# Altium project PCB3.PrjPcb
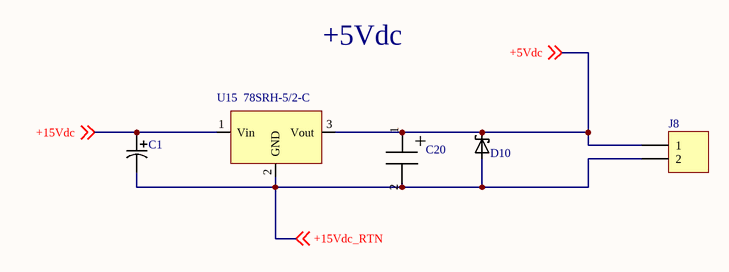
[diagram p0: +5Vdc.SchDoc]
4 sheets, 68 parts. Net scope: flat (ports and power ports of the same name join across sheets).
Board file: Hoja6_8.PcbDoc
Sheets:
  +5Vdc.SchDoc
  +15V_fire.SchDoc
  Control_tensiones.SchDoc
  Enable_Pulse_fire.SchDoc

## Sheet +5Vdc.SchDoc
size A3

### Parts
C1  UBC1H470MNS1GS  [UBC1H470MNS1GS]  (value not drawn)
C20  10SVPC120M  [PANASONIC SVPC SERIES]  (value not drawn)
D10  SMCJ5.0A  [TVS Diode DO-214AB-2 (SMC)]  (value not drawn)
J8  Header 2  [HDR1X2]  (value not drawn)
U15  78SRH-5/2-C  [78SR-5/2-C]

### Nets
+5Vdc: C20.1 D10.C J8.1 U15.3(Vout) ; off-sheet +5Vdc
+15Vdc: C1.1 U15.1(Vin) ; off-sheet +15Vdc
+15Vdc_RTN: C1.2 C20.2 D10.A J8.2 U15.2(GND) ; off-sheet +15Vdc_RTN

### Notes on the sheet
- +5Vdc
- (in symbol Panasonic electrolitic cap SVPC) +

### Library data of the parts
C1 = Nichicon electrolitic capacitor: MD 50volts 47uF; ComponentLink1Description: UBC1H470MNS1GS; ComponentLink1URL: https://www.mouser.es/ProductDetail/Nichicon/UBC1H470MNS1GS?qs=U1PqRs5SEBtOy06pTkWJCw%3D%3D&vip=1&gclid=CjwKCAjwqpP2BRBTEiwAfpiD-zT2IHj2dmGJDoxoCUlwFGgo7ytp52iPk_zVmh_n4eTfZDHl6q4jrxoCD5AQAvD_BwE
C20 = Panasonic electrolitic cap SVPC: 10volts 120uF ESR 27mohm; ComponentLink1Description: 10SVPC120M; ComponentLink1URL: https://www.mouser.es/ProductDetail/Panasonic/10SVPC120M?qs=sGAEpiMZZMsIwzbKW1rlgZRRlI97jKasVTg%2Fx1x3B4w%3D
D10 = TVS SMCJxxA: SMC do-214AB-2; ComponentLink1Description: SMCJ5.0A; ComponentLink1URL: https://www.mouser.es/ProductDetail/Bourns/SMCJ50A?qs=%252Bf8Cd6aE5bxP5YHLnOwndA%3D%3D
J8 = Header 2: Header, 2-Pin; LatestRevisionDate: 17-Jul-2002; LatestRevisionNote: Re-released for DXP Platform.; Publisher: Altium Limited
U15 = 78SR-5/2-C: Convertidores CC/CC no aislados 8-32Vin 5Vout 2A SIP Switching Reg.; ComponentLink1Description: 78SRH-5/2-C; ComponentLink1URL: https://www.mouser.es/ProductDetail/Murata-Power-Solutions/78SRH-5-2-C?qs=%2Fha2pyFaduhqPOpHwIdzX%252BmJBXU5MwVRtt0xC2MUQi8aOSO3n%252BGaGw%3D%3D; ComponentLink2Description: Datasheet; ComponentLink2URL: https://www.mouser.es/datasheet/2/281/mpm_78sr-2a_a00-42390.pdf

## Sheet +15V_fire.SchDoc
size A3
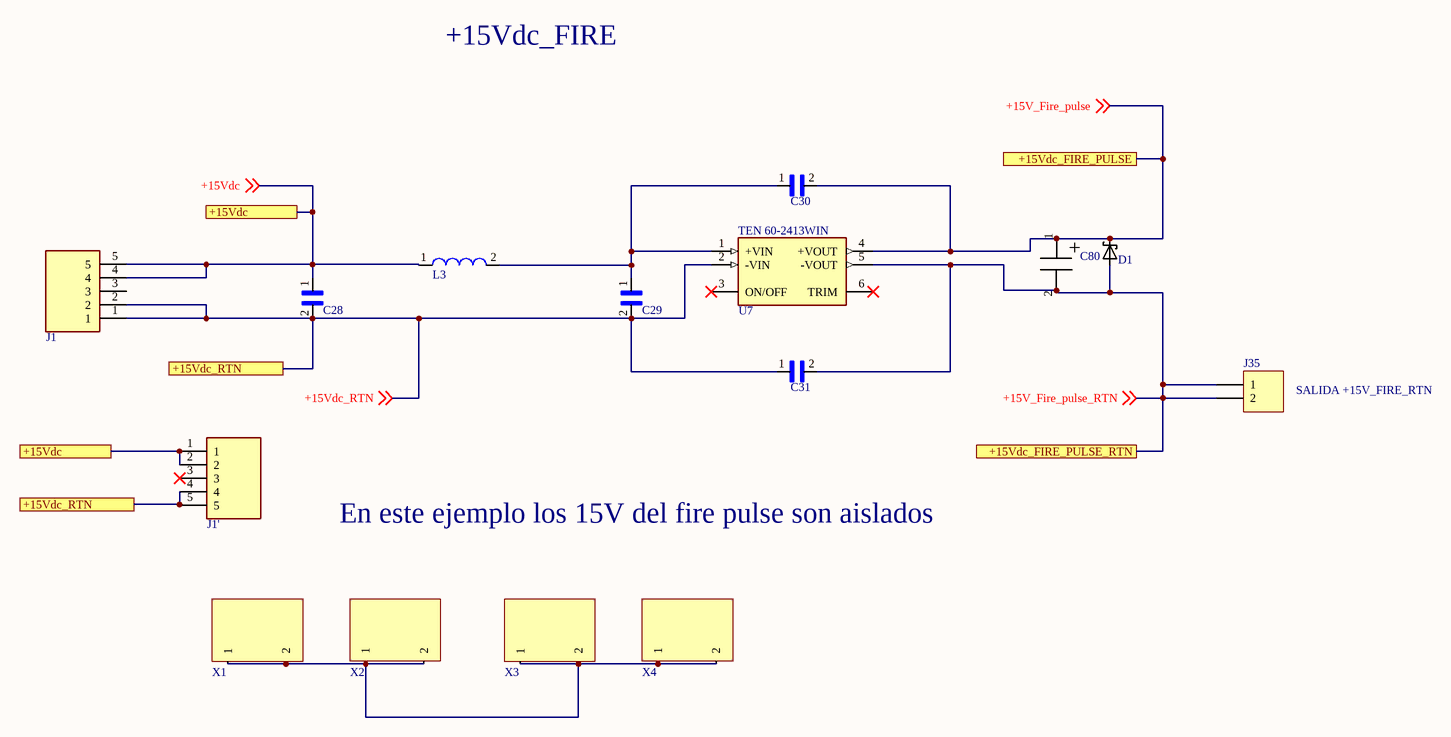
[diagram p1: +15V_fire.SchDoc]

### Parts
C28  KTF500B685M43NHT00  [MLCC SMD 1812 50V]  (value not drawn)
C29  KTF500B685M43NHT00  [MLCC SMD 1812 50V]  (value not drawn)
C30  C1206X102KGRACAUTO  [MLCC SMD 1206]  (value not drawn)
C31  C1206X102KGRACAUTO  [MLCC SMD 1206]  (value not drawn)
C80  EEE-FK1V100R  [PANASONIC FK SERIES]  (value not drawn)
D1  SMCJ15A  [TVS Diode DO-214AB-2 (SMC)]  (value not drawn)
J1  Pin Header 5x1 MASC  [PIN HEADER 5X1 MASC]  (value not drawn)
J1'  Pin Header 5x1 MASC  [PIN HEADER 5X1 MASC]  (value not drawn)
J35  Header 2  [HDR1X2]  (value not drawn)
L3  TCK-102  [TCK-102]  (value not drawn)
U7  TEN 60-2413WIN  [TEN 60WIN Series]
X1  7466310R  [7466310R]  (value not drawn)
X2  7466310R  [7466310R]  (value not drawn)
X3  7466310R  [7466310R]  (value not drawn)
X4  7466310R  [7466310R]  (value not drawn)

### Ports
+15Vdc, +15Vdc_FIRE_PULSE, +15Vdc_FIRE_PULSE_RTN, +15Vdc_RTN

### Nets
+15V_Fire_pulse: C30.2 C80.1 D1.C U7.4(+VOUT) ; off-sheet +15V_Fire_pulse, port +15Vdc_FIRE_PULSE
+15V_Fire_pulse_RTN: C31.2 C80.2 D1.A J35.1 J35.2 U7.5(-VOUT) ; off-sheet +15V_Fire_pulse_RTN, port +15Vdc_FIRE_PULSE_RTN
+15Vdc: C28.1 J1.4 J1.5 J1'.1 J1'.2 L3.1 ; off-sheet +15Vdc, port +15Vdc
+15Vdc_RTN: C28.2 C29.2 C31.1 J1.1 J1.2 J1'.4 J1'.5 U7.2(-VIN) ; off-sheet +15Vdc_RTN, port +15Vdc_RTN
NetC29_1: C29.1 C30.1 L3.2 U7.1(+VIN)
NetX1_1: X1.1 X1.2 X2.1 X2.2 X3.1 X3.2 X4.1 X4.2

Not connected (* = marked no-connect by the designer): J1 3; J1' 3*; U7 3(ON/OFF)* 6(TRIM)*

### Notes on the sheet
- +15Vdc_FIRE
- (near J35) SALIDA +15V_FIRE_RTN
- En este ejemplo los 15V del fire pulse son aislados
- (in symbol Panasonic electrolitic cap FK) +

### Library data of the parts
C28 C29 = MLCC - SMD 1812: 6.8uF, 50V; ComponentLink1Description: KTF500B685M43NHT00; ComponentLink1URL: https://www.mouser.es/ProductDetail/United-Chemi-Con/KTF500B685M43NHT00?qs=sGAEpiMZZMs0AnBnWHyRQGxBDRtFRp5z4bchVqSxespDGMPT39T5iA%3D%3D
C30 C31 = MLCC - SMD 1206: 1000Pf, 2KV; ComponentLink1Description: C1206X102KGRACAUTO; ComponentLink1URL: https://www.mouser.es/ProductDetail/KEMET/C1206X102KGRACAUTO?qs=sGAEpiMZZMs0AnBnWHyRQN7%2FAA2D2lPPgicmiaZAeQEuINLX1UMksw%3D%3D
C80 = Panasonic electrolitic cap FK: 10uF, 35V; ComponentLink1Description: EEE-FK1V100R; ComponentLink1URL: https://www.mouser.es/ProductDetail/Panasonic/EEE-FK1V100R?qs=%2Fha2pyFaduj%2FIt2M0EHCFH6KCxiBIGyUhvn03lKjROYI3CJTVtBsWg%3D%3D
D1 = TVS SMCJxxA: SMC do-214AB-2; ComponentLink1Description: SMCJ15A; ComponentLink1URL: https://www.mouser.es/ProductDetail/Taiwan-Semiconductor/SMCJ15A?qs=sGAEpiMZZMvxHShE6Whpu8fatLI1nnJdRhHnBKQQd%2F4%3D
J1 J1' = Pin Header 5x1 MASC: 5x1 Straight MASC
J35 = Header 2: Header, 2-Pin; LatestRevisionDate: 17-Jul-2002; LatestRevisionNote: Re-released for DXP Platform.; Publisher: Altium Limited
L3 = TCK-102: Inductores fijos EMC Chokes for DC/DC Converters 3.3 µH ±20% 18 mOhm max. 10Amax; ComponentLink1Description: TCK-102; ComponentLink1URL: https://www.mouser.es/datasheet/2/687/tck102-1530275.pdf; ComponentLink2Description: TCK-102; ComponentLink2URL: https://www.mouser.es/ProductDetail/TRACO-Power/TCK-102?qs=sGAEpiMZZMvzWM6X48YRJGsDNyjYsBLz4RP5FeQoV5Q%3D
U7 = TEN 60-2413WIN: Convertidores CC/CC aislados  Output Power (W): 60; Input Voltage: 9-36 VDC; Output 1 (Vdc): 15;; ComponentLink1Description: Datasheet; ComponentLink1URL: https://www.tracopower.com/sites/default/files/products/datasheets/ten60win_datasheet.pdf; ComponentLink2Description: TEN 60-2413WIN; ComponentLink2URL: https://www.mouser.es/ProductDetail/TRACO-Power/TEN-60-2413WIN?qs=sGAEpiMZZMvGsmoEFRKS8GuhBnqedIdiF3IPykuOfGu%2FdWm0yPRwSg%3D%3D
X1-X4 = 7466310R Conector: ComponentLink1Description: 7466310R; ComponentLink1URL: https://es.rs-online.com/web/p/terminales-roscados/1424083/

## Sheet Control_tensiones.SchDoc
size A3
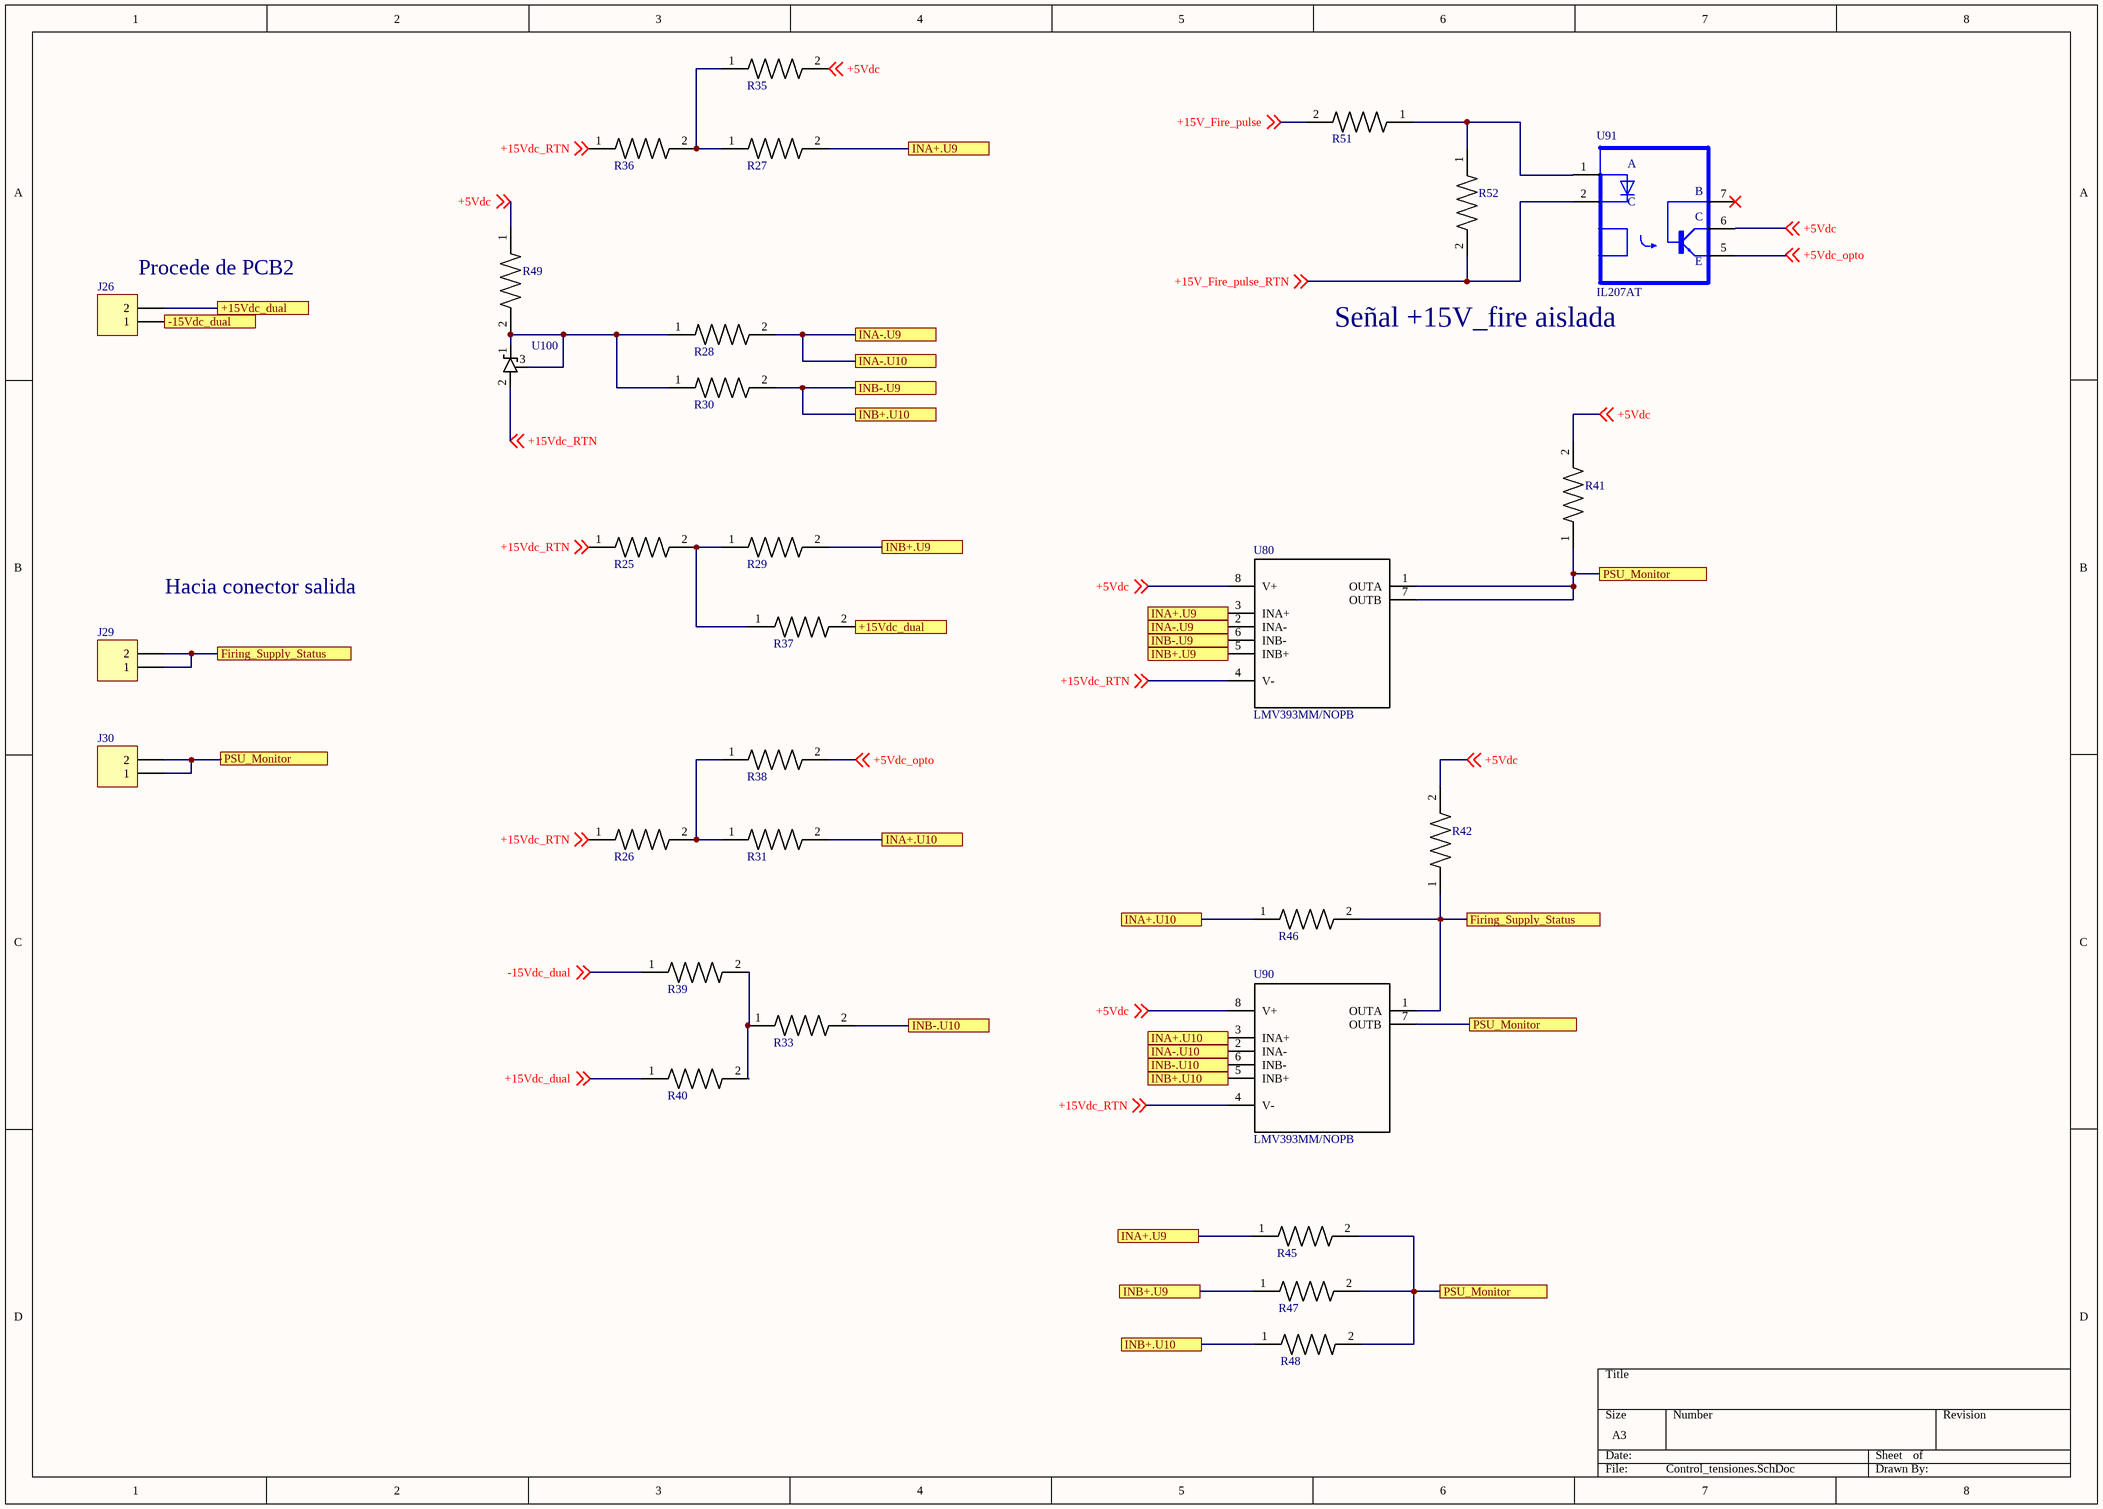
[diagram p2: Control_tensiones.SchDoc]

### Parts
J26  Header 2  [HDR1X2]  (value not drawn)
J29  Header 2  [HDR1X2]  (value not drawn)
J30  Header 2  [HDR1X2]  (value not drawn)
R25  MCT06030C2261FP500  [VISHAY RESISTOR 0603]  (value not drawn)
R26  MCT06030C2261FP500  [VISHAY RESISTOR 0603]  (value not drawn)
R27  MCT06030C4751FP500  [VISHAY RESISTOR 0603]  (value not drawn)
R28  MCT06030C4751FP500  [VISHAY RESISTOR 0603]  (value not drawn)
R29  MCT06030C4751FP500  [VISHAY RESISTOR 0603]  (value not drawn)
R30  MCT06030C4751FP500  [VISHAY RESISTOR 0603]  (value not drawn)
R31  MCT06030C4751FP500  [VISHAY RESISTOR 0603]  (value not drawn)
R33  MCT06030C4751FP500  [VISHAY RESISTOR 0603]  (value not drawn)
R35  MCT06030C8251FP500  [VISHAY RESISTOR 0603]  (value not drawn)
R36  MCT06030E1002BP500  [VISHAY RESISTOR 0603]  (value not drawn)
R37  MCT06030E1002BP500  [VISHAY RESISTOR 0603]  (value not drawn)
R38  MCT06030C8251FP500  [VISHAY RESISTOR 0603]  (value not drawn)
R39  MCT06030E1002BP500  [VISHAY RESISTOR 0603]  (value not drawn)
R40  MCT06030E1002BP500  [VISHAY RESISTOR 0603]  (value not drawn)
R41  MCT06030E1002BP500  [VISHAY RESISTOR 0603]  (value not drawn)
R42  MCT06030E1002BP500  [VISHAY RESISTOR 0603]  (value not drawn)
R45  MCT06030C2213FP500  [VISHAY RESISTOR 0603]  (value not drawn)
R46  MCT06030C2213FP500  [VISHAY RESISTOR 0603]  (value not drawn)
R47  MCT06030C2213FP500  [VISHAY RESISTOR 0603]  (value not drawn)
R48  MCT06030C2213FP500  [VISHAY RESISTOR 0603]  (value not drawn)
R49  MCT06030C1001FP500  [VISHAY RESISTOR 0603]  (value not drawn)
R51  CR1206-FX-3921ELF  [Vishay Resistor 1206]  (value not drawn)
R52  CR1206-FX-2211ELF  [Vishay Resistor 1206]  (value not drawn)
U80  LMV393MM/NOPB  [VSSOP-8]
U90  LMV393MM/NOPB  [VSSOP-8]
U91  IL207AT  [IL207AT]
U100  LM431BIM3/NOPB  [LM431BIM3/NOPB]  (value not drawn)

### Ports
+15Vdc_dual, -15Vdc_dual, Firing_Supply_Status, INA+.U9, INA+.U10, INA-.U9, INA-.U10, INB+.U9, INB+.U10, INB-.U9, INB-.U10, PSU_Monitor

### Nets
+5Vdc: R35.2 R41.2 R42.2 R49.1 U80.8(V+) U90.8(V+) U91.6(C) ; off-sheet +5Vdc
+5Vdc_opto: R38.2 U91.5(E) ; off-sheet +5Vdc_opto
+15V_Fire_pulse: R51.2 ; off-sheet +15V_Fire_pulse
+15V_Fire_pulse_RTN: R52.2 U91.2(K) ; off-sheet +15V_Fire_pulse_RTN
+15Vdc_dual: R40.1 ; off-sheet +15Vdc_dual
+15Vdc_RTN: R25.1 R26.1 R36.1 U80.4(V-) U90.4(V-) U100.2 ; off-sheet +15Vdc_RTN
-15Vdc_dual: R39.1 ; off-sheet -15Vdc_dual
NetJ26_1: J26.1 ; port -15Vdc_dual
NetJ26_2: J26.2 R37.2 ; port +15Vdc_dual
NetJ29_1: J29.1 J29.2 R42.1 R46.2 U90.1(OUTA) ; port Firing_Supply_Status
NetJ30_1: J30.1 J30.2 R41.1 R45.2 R47.2 R48.2 U80.1(OUTA) U80.7(OUTB) U90.7(OUTB) ; port PSU_Monitor
NetR25_2: R25.2 R29.1 R37.1
NetR26_2: R26.2 R31.1 R38.1
NetR27_1: R27.1 R35.1 R36.2
NetR27_2: R27.2 R45.1 U80.3(INA+) ; port INA+.U9
NetR28_1: R28.1 R30.1 R49.2 U100.1 U100.3
NetR28_2: R28.2 U80.2(INA-) U90.2(INA-) ; port INA-.U9, port INA-.U10
NetR29_2: R29.2 R47.1 U80.5(INB+) ; port INB+.U9
NetR30_2: R30.2 R48.1 U80.6(INB-) U90.5(INB+) ; port INB-.U9, port INB+.U10
NetR31_2: R31.2 R46.1 U90.3(INA+) ; port INA+.U10
NetR33_1: R33.1 R39.2 R40.2
NetR33_2: R33.2 U90.6(INB-) ; port INB-.U10
NetR51_1: R51.1 R52.1 U91.1(A)

Not connected (* = marked no-connect by the designer): U91 7(B)*

### Notes on the sheet
- (near J26) Procede de PCB2
- Señal +15V_fire aislada
- Hacia conector salida

### Library data of the parts
J26 J29 J30 = Header 2: Header, 2-Pin; LatestRevisionDate: 17-Jul-2002; LatestRevisionNote: Re-released for DXP Platform.; Publisher: Altium Limited
R25 R26 = Vishay: SMD .1W 2.26Kohms 1% 0603 50ppm; ComponentLink1Description: MCT06030C2261FP500; ComponentLink1URL: https://www.mouser.es/ProductDetail/Vishay-Beyschlag/MCT06030C2261FP500?qs=%2Fha2pyFadughkIXC22QiYpvHZcDRlhgpmBDp13US%252BZ0hODV2hOC%2FTUaEC1yDML2l
R27-R31 R33 = Vishay: SMD .1W 4.75Kohm 1% 0603; ComponentLink1Description: MCT06030C4751FP500; ComponentLink1URL: https://www.mouser.es/ProductDetail/Vishay-Beyschlag/MCT06030C4751FP500?qs=%2Fha2pyFadughkIXC22QiYi0CgI7B%2FEwZF1Ozbr1oOh0X%252BJ1hWtmp5jEjAUZkpAxV
R35 R38 = Vishay: 8.25K; ComponentLink1Description: MCT06030C8251FP500; ComponentLink1URL: https://www.mouser.es/ProductDetail/Vishay-Beyschlag/MCT06030C8251FP500?qs=sGAEpiMZZMukHu%252BjC5l7YZ4AW6xLIgwogvAy%252BPWxcIo%3D
R36 R37 R39-R42 = Vishay: 10K; ComponentLink1Description: MCT06030E1002BP500; ComponentLink1URL: https://www.mouser.es/ProductDetail/Vishay-Beyschlag/MCT06030E1002BP500?qs=%2Fha2pyFadughkIXC22QiYn1joc4AhucvlApKkzkxat0vQHQ4MiMQdVZR1CdxMQHv
R45-R48 = Vishay: 221K; ComponentLink1Description: MCT06030C2213FP500; ComponentLink1URL: https://www.mouser.es/ProductDetail/Vishay-Beyschlag/MCT06030C2213FP500?qs=%2Fha2pyFadughkIXC22QiYqLjBpdqF1aqE52QKndS2LMwEPewZL3fBw%3D%3D
R49 = Vishay: 1K; ComponentLink1Description: MCT06030C1001FP500; ComponentLink1URL: https://www.mouser.es/ProductDetail/Vishay-Beyschlag/MCT06030C1001FP500?qs=%2Fha2pyFadughkIXC22QiYtrFzwOcctIEKEUg7pOtZAzbqCmtrkpt9w%3D%3D
R51 = Vishay: SMD 3.92K 1%; ComponentLink1Description: CR1206-FX-3921ELF; ComponentLink1URL: https://www.mouser.es/ProductDetail/Bourns/CR1206-FX-3921ELF?qs=raSpJxvwqHE9GBxJCDuxsA%3D%3D
R52 = Vishay: SMD 2.21K 1%; ComponentLink1Description: CR1206-FX-2211ELF; ComponentLink1URL: https://www.mouser.es/ProductDetail/Bourns/CR1206-FX-2211ELF?qs=%2Fha2pyFaduj9c30axezgKfVr70F7xSB9ko%2Fa2tHaHRQ2Kj0njWzInQ%3D%3D
U80 U90 = LMV393MM/NOPB: Low Volt Dual Comp; ComponentLink1Description: Datasheets; ComponentLink1URL: https://www.ti.com/lit/ds/symlink/lmv393-n.pdf; ComponentLink2Description: LMV393MM/NOPB; ComponentLink2URL: https://www.mouser.es/ProductDetail/Texas-Instruments/LMV393MM-NOPB?qs=sGAEpiMZZMuayl%2FEk2kXcbEcxwmoPguckCV8aQGpZH0=
U91 = IL207AT: Optoacopladores para salidas de transistores Phototransistor Out Single CTR; ComponentLink1Description: IL207AT; ComponentLink1URL: https://www.mouser.es/ProductDetail/Vishay-Semiconductors/IL207AT?qs=llh2rRbZq4tx89Mr596kGw==&vip=1&gclid=Cj0KCQjw6uT4BRD5ARIsADwJQ1-1DfbQcymhOgpkcRTr_MH4AofkADIKJJHZSotrTBYXAbAfQbOPfvcaAg7REALw_wcB
U100 = LM431BIM3/NOPB: Referencias de voltaje ADJ PREC ZENER SHUNT REG; ComponentLink1Description: Datasheets; ComponentLink1URL: http://www.ti.com/lit/ds/symlink/lm431.pdf; ComponentLink2Description: LM431BIM3/NOPB; ComponentLink2URL: https://www.mouser.es/ProductDetail/Texas-Instruments/LM431BIM3-NOPB?qs=sGAEpiMZZMuBck1X%252B7j9fFxOFMTVQaIHvc6TlFQ3VqM%3D

## Sheet Enable_Pulse_fire.SchDoc
size A3
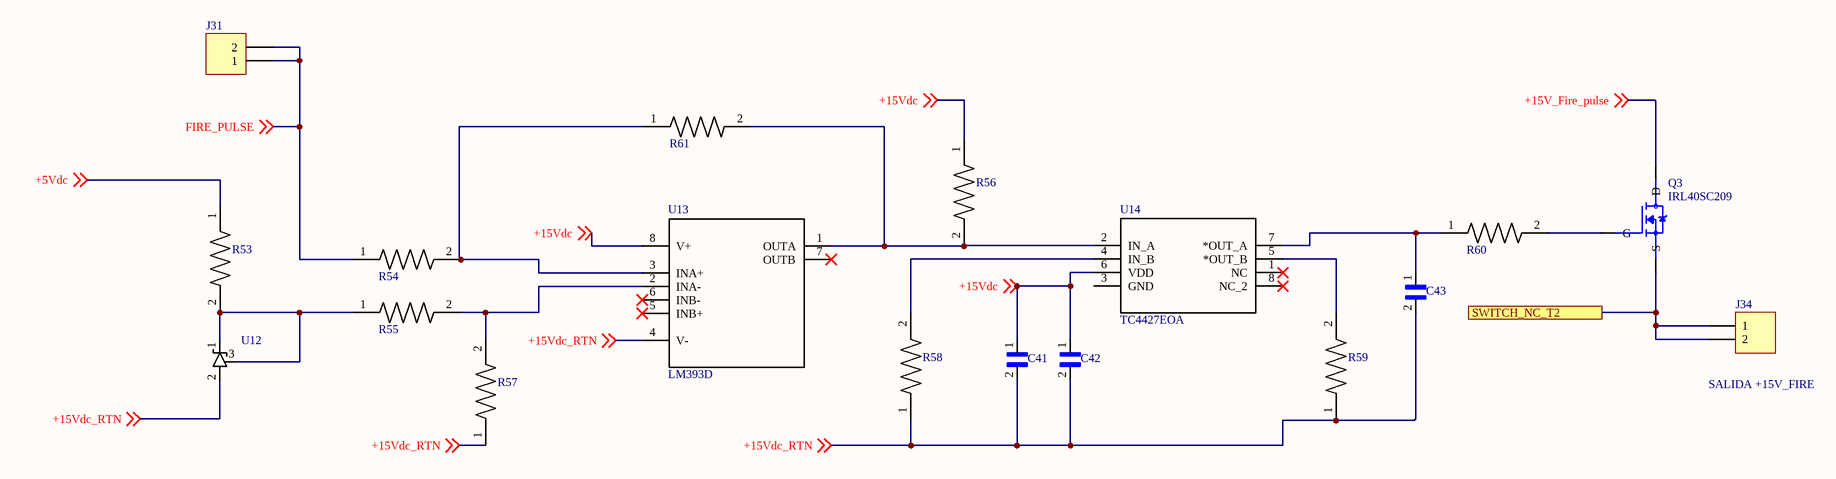
[diagram p3: Enable_Pulse_fire.SchDoc]

### Parts
C41  UMK316AC7475KLHTE  [MLCC SMD 1206]  (value not drawn)
C42  UMF316B7105KLHT  [MLCC SMD 1206]  (value not drawn)
C43  UMF316B7103MFHT  [MLCC SMD 1206]  (value not drawn)
J31  Header 2  [HDR1X2]  (value not drawn)
J34  Header 2  [HDR1X2]  (value not drawn)
Q3  IRL40SC209  [D2PAK-7]
R53  RCG12061K00FKEA  [Vishay Resistor 1206]  (value not drawn)
R54  RCG12061K00FKEA  [Vishay Resistor 1206]  (value not drawn)
R55  RCG12061K00FKEA  [Vishay Resistor 1206]  (value not drawn)
R56  RCG12061K00FKEA  [Vishay Resistor 1206]  (value not drawn)
R57  CRCW12064K02FKEAC  [Vishay Resistor 1206]  (value not drawn)
R58  CRCW12060000Z0EAC  [Vishay Resistor 1206]  (value not drawn)
R59  CRCW12060000Z0EAC  [Vishay Resistor 1206]  (value not drawn)
R60  CRCW12064R70FKEAC  [Vishay Resistor 1206]  (value not drawn)
R61  CRCW1206121KFKEA  [Vishay Resistor 1206]  (value not drawn)
U12  LM431BIM3/NOPB  [LM431BIM3/NOPB]  (value not drawn)
U13  LM393D  [SOIC-8]
U14  TC4427EOA  [TC4427EOA]

### Ports
SWITCH_NC_T2

### Nets
+5Vdc: R53.1 ; off-sheet +5Vdc
+15V_Fire_pulse: Q3.D ; off-sheet +15V_Fire_pulse
+15Vdc: C41.1 C42.1 R56.1 U13.8(V+) U14.6(VDD) ; off-sheet +15Vdc
+15Vdc_RTN: C41.2 C42.2 C43.2 R57.1 R58.1 R59.1 U12.2 U13.4(V-) ; off-sheet +15Vdc_RTN
FIRE_PULSE: J31.1 J31.2 R54.1 ; off-sheet FIRE_PULSE
NetC43_1: C43.1 R60.1 U14.7(*OUT_A)
NetJ34_1: J34.1 J34.2 Q3.S ; port SWITCH_NC_T2
NetQ3_G: Q3.G R60.2
NetR53_2: R53.2 R55.1 U12.1 U12.3
NetR54_2: R54.2 R61.1 U13.3(INA+)
NetR55_2: R55.2 R57.2 U13.2(INA-)
NetR56_2: R56.2 R61.2 U13.1(OUTA) U14.2(IN_A)
NetR58_2: R58.2 U14.4(IN_B)
NetR59_2: R59.2 U14.5(*OUT_B)

Not connected (* = marked no-connect by the designer): U13 5(INB+)* 6(INB-)* 7(OUTB)*; U14 1(NC)* 3(GND) 8(NC_2)*

### Notes on the sheet
- (near J34) SALIDA +15V_FIRE

### Library data of the parts
C41 = Taiyo Yuden: 1216 50V 4.7uF 10% X7S; ComponentLink1Description: UMK316AC7475KLHTE; ComponentLink1URL: https://www.mouser.es/ProductDetail/Taiyo-Yuden/UMK316AC7475KLHTE?qs=sGAEpiMZZMs0AnBnWHyRQPSjYu%2Fkbgu8BJH7ma7m9%2FAubYLGLnAQNQ%3D%3D
C42 = Taiyo Yuden: 1206 50V 1uF 10%; ComponentLink1Description: UMF316B7105KLHT; ComponentLink1URL: https://www.mouser.es/ProductDetail/Taiyo-Yuden/UMF316B7105KLHT?qs=sGAEpiMZZMs0AnBnWHyRQNStjhAUP4u8IFiqcRtjyKUDsygV%252B%252BauIQ%3D%3D
C43 = Taiyo Yuden: 1206 50V 0.01uF 20%; ComponentLink1Description: UMF316B7103MFHT; ComponentLink1URL: https://www.mouser.es/ProductDetail/Taiyo-Yuden/UMF316B7103MFHT?qs=sGAEpiMZZMs0AnBnWHyRQNStjhAUP4u85ccYWuzgIHbm0bjeY2qbAQ%3D%3D
J31 J34 = Header 2: Header, 2-Pin; LatestRevisionDate: 17-Jul-2002; LatestRevisionNote: Re-released for DXP Platform.; Publisher: Altium Limited
Q3 = IRL40SC209: MOSFET TRENCH <= 40V; ComponentLink1Description: Datasheet; ComponentLink1URL: https://www.mouser.es/datasheet/2/196/Infineon-IRL40SC209-DS-v02_02-EN-1732032.pdf; ComponentLink2Description: https://www.mouser.es/ProductDetail/Infineon-Technologies/IRL40SC209?qs=%252BdQmOuGyFcGGt2Q5zMahtw==; ComponentLink2URL: IRL40SC209
R53-R56 = Vishay: 1K; ComponentLink1Description: RCG12061K00FKEA; ComponentLink1URL: https://www.mouser.es/ProductDetail/Vishay-Draloric/RCG12061K00FKEA?qs=sGAEpiMZZMvdGkrng054t%2FOb%2F3W47a3IfG8pBRzhcNk%3D
R57 = Vishay: 4K; ComponentLink1Description: CRCW12064K02FKEAC; ComponentLink1URL: https://www.mouser.es/ProductDetail/Vishay-Dale/CRCW12064K02FKEAC?qs=sGAEpiMZZMvdGkrng054t0DrEhLhGh8g4Tnz4k1T80cWvTBGCv6WCg%3D%3D
R58 R59 = Vishay: 0OHM; ComponentLink1Description: CRCW12060000Z0EAC; ComponentLink1URL: https://www.mouser.es/ProductDetail/Vishay-Dale/CRCW12060000Z0EAC?qs=sGAEpiMZZMvdGkrng054t0DrEhLhGh8gmWu5YO3o1qhRpAhriXClmA%3D%3D
R60 = Vishay: 4.7OHM; ComponentLink1Description: CRCW12064R70FKEAC; ComponentLink1URL: https://www.mouser.es/ProductDetail/Vishay-Dale/CRCW12064R70FKEAC?qs=sGAEpiMZZMvdGkrng054t0DrEhLhGh8g7se0aMUU2GFN560coxHGKA%3D%3D
R61 = Vishay: 121K; ComponentLink1Description: CRCW1206121KFKEA; ComponentLink1URL: https://www.mouser.es/ProductDetail/Vishay-Dale/CRCW1206121KFKEA?qs=sGAEpiMZZMukHu%252BjC5l7YbqP04GeSeqX%252BpAfvKVU%2F%2F0%3D
U12 = LM431BIM3/NOPB: as U100 on sheet Control_tensiones; ComponentLink1Description: Datasheets; ComponentLink1URL: http://www.ti.com/lit/ds/symlink/lm431.pdf; ComponentLink2Description: LM431BIM3/NOPB; ComponentLink2URL: https://www.mouser.es/ProductDetail/Texas-Instruments/LM431BIM3-NOPB?qs=sGAEpiMZZMuBck1X%252B7j9fFxOFMTVQaIHvc6TlFQ3VqM%3D
U14 = TC4427EOA: Controlador de puerta 1.5A Dual MOSFET Dr NonInver Etemp SOIC8
U13 = LM393D: ComponentLink1Description: Datasheet; ComponentLink1URL: http://www.ti.com/lit/ds/symlink/lm393.pdf?ts=1588059857251; ComponentLink2Description: LM393DR; ComponentLink2URL: https://www.mouser.es/ProductDetail/Texas-Instruments/LM393DR?qs=8k%2FZSzWMuCP%2FrtMSX0i7pQ%3D%3D

## Nets that join several sheets
+5Vdc: +5Vdc (C20.1 D10.C J8.1 U15.3), Control_tensiones (7 pins), Enable_Pulse_fire (R53.1)
+15V_Fire_pulse: +15V_fire (C30.2 C80.1 D1.C U7.4), Control_tensiones (R51.2), Enable_Pulse_fire (Q3.D)
+15V_Fire_pulse_RTN: +15V_fire (6 pins), Control_tensiones (R52.2 U91.2)
+15Vdc: +5Vdc (C1.1 U15.1), +15V_fire (6 pins), Enable_Pulse_fire (5 pins)
+15Vdc_RTN: +5Vdc (5 pins), +15V_fire (8 pins), Control_tensiones (6 pins), Enable_Pulse_fire (8 pins)